# Altium schematic sheet [02] - CPU.SchDoc: Desk Digital Clock
size A4; DrawnBy: Ramil Teregulov; Address1: https://github.com/teregulov; Address2: https://github.com/teregulov/Desk-Digital-Clock; DocumentNumber: DDC-2; Revision: 1R0; SheetNumber: 2; SheetTotal: 7
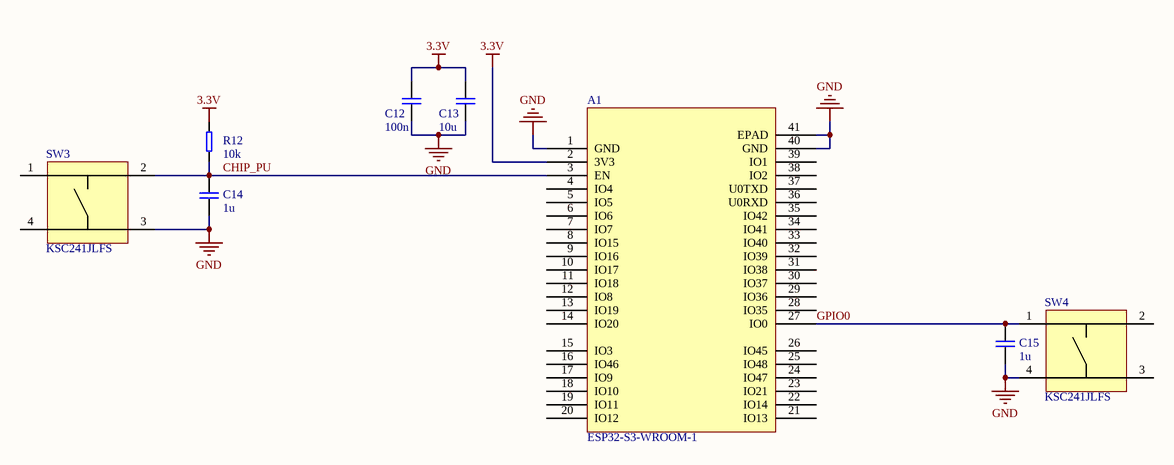
[diagram p0: [02] - CPU.SchDoc]

## Parts
A1  ESP32-S3-WROOM-1  [ESP32-S3-WROOM-1]
C12  100n  [C0603]
C13  10u  [C0603]
C14  1u  [C0603]
C15  1u  [C0603]
R12  10k  [R0603]
SW3  KSC241JLFS  [KSC241JLFS]
SW4  KSC241JLFS  [KSC241JLFS]

## Nets
3.3V: A1.2(3V3) C12.1 C13.1 R12.2
GND: A1.1(GND) A1.40(GND) A1.41(EPAD) C12.2 C13.2 C14.2 C15.2 SW3.3 SW4.4
CHIP_PU: A1.3(EN) C14.1 R12.1 SW3.2
GPIO0: A1.27(IO0) C15.1 SW4.1

Not connected (* = marked no-connect by the designer): A1 4(IO4) 5(IO5) 6(IO6) 7(IO7) 8(IO15) 9(IO16) 10(IO17) 11(IO18) 12(IO8) 13(IO19) 14(IO20) 15(IO3) 16(IO46) 17(IO9) 18(IO10) 19(IO11) 20(IO12) 21(IO13) 22(IO14) 23(IO21) 24(IO47) 25(IO48) 26(IO45) 28(IO35) 29(IO36) 30(IO37) 31(IO38) 32(IO39) 33(IO40) 34(IO41) 35(IO42) 36(U0RXD) 37(U0TXD) 38(IO2) 39(IO1); SW3 1 4; SW4 2 3

## Notes on the sheet
- Title:
- Size:
- Date:
- A4
- Number:
- Time:
- Revision:
- Sheet
- of
- File:

## Library data of the parts
A1 = ESP32-S3-WROOM-1: 2.4 GHz Wi-Fi (802.11 b/g/n) and Bluetooth® 5 (LE) module; Manufacturer: espressif; Datasheet: https://www.espressif.com/sites/default/files/documentation/esp32-s3-wroom-1_wroom-1u_datasheet_en.pdf; P/N: ESP32-S3-WROOM-1
C12-C15 = Cap: CAPACITOR
  C12: Value: 100n
  C13: Value: 10u
  C14 C15: Value: 1u
R12 = Res: RESISTOR; Value: 10k
SW3 SW4 = KSC241JLFS: SWITCH TACTILE SPST-NO 50mA @ 32VDC; Manufacturer: C&K; P/N: KSC241JLFS; Datasheet: https://www.ckswitches.com/media/1968/ksc2.pdf